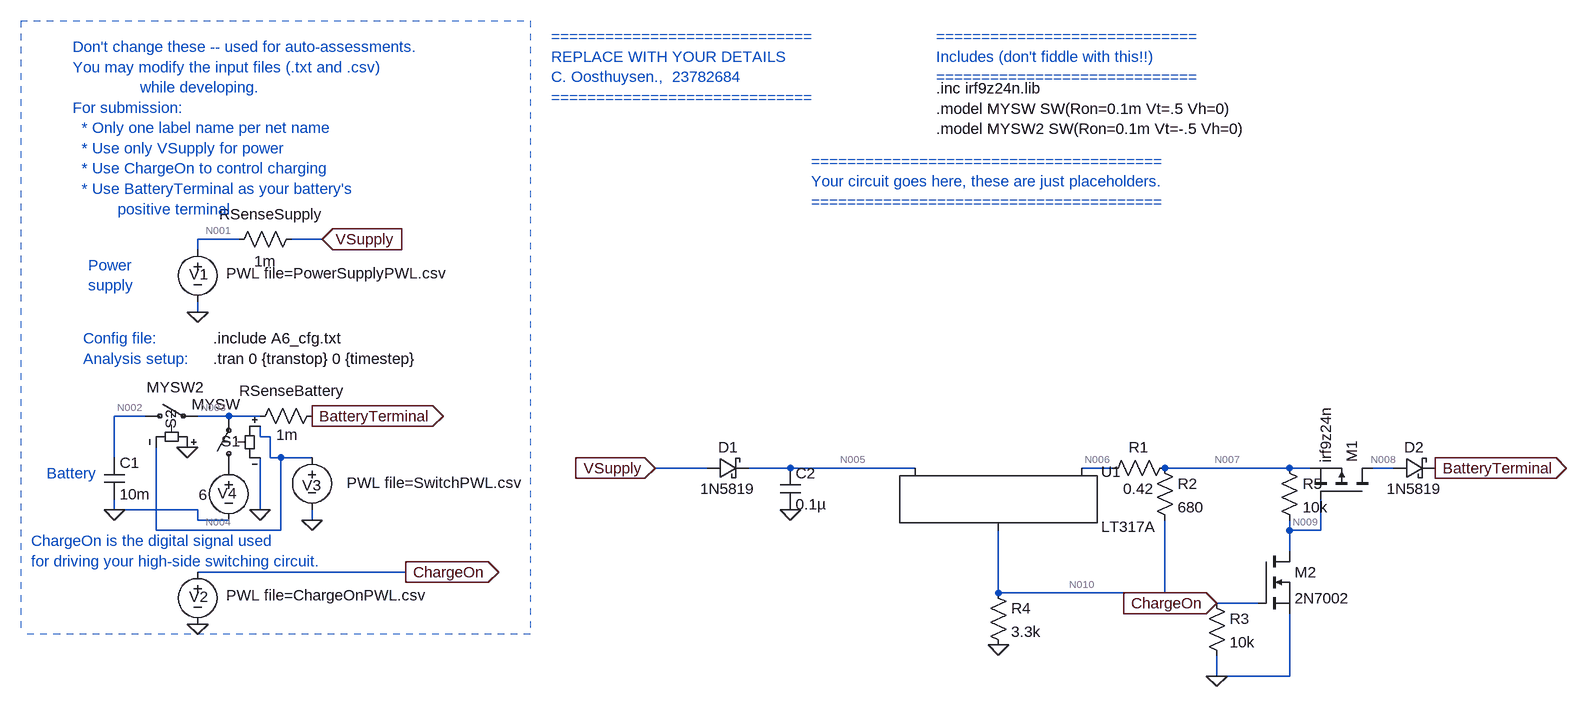
[diagram p0: schematic E344_23782684_A6b.asc]
E344_23782684_A6b.asc, the LTspice schematic file:
Version 4
SHEET 1 1824 680
WIRE -2032 -1088 -2096 -1088
WIRE -1904 -1088 -1952 -1088
WIRE -2096 -1072 -2096 -1088
WIRE -2096 -976 -2096 -992
WIRE -2176 -816 -2224 -816
WIRE -2048 -816 -2096 -816
WIRE -2000 -816 -2048 -816
WIRE -2000 -784 -2000 -800
WIRE -1984 -784 -2000 -784
WIRE -2224 -752 -2224 -816
WIRE -1984 -752 -1984 -784
WIRE -1968 -752 -1984 -752
WIRE -1920 -752 -1968 -752
WIRE -1312 -736 -1392 -736
WIRE -1184 -736 -1248 -736
WIRE -992 -736 -1184 -736
WIRE -688 -736 -736 -736
WIRE -416 -736 -608 -736
WIRE -384 -736 -416 -736
WIRE -256 -736 -288 -736
WIRE -2224 -672 -2224 -688
WIRE -2096 -672 -2224 -672
WIRE -2000 -672 -2000 -752
WIRE -2096 -656 -2096 -672
WIRE -2048 -656 -2096 -656
WIRE -1920 -656 -1920 -672
WIRE -2160 -640 -2160 -768
WIRE -1968 -640 -1968 -752
WIRE -1968 -640 -2160 -640
WIRE -416 -640 -416 -656
WIRE -368 -640 -368 -688
WIRE -368 -640 -416 -640
WIRE -416 -608 -416 -640
WIRE -1776 -576 -2096 -576
WIRE -864 -544 -864 -640
WIRE -608 -544 -608 -656
WIRE -608 -544 -864 -544
WIRE -464 -528 -528 -528
WIRE -528 -416 -528 -448
WIRE -416 -416 -416 -512
WIRE -416 -416 -528 -416
FLAG -2096 -976 0
FLAG -1904 -1088 VSupply
IOPIN -1904 -1088 In
FLAG -1920 -816 BatteryTerminal
IOPIN -1920 -816 Out
FLAG -1776 -576 ChargeOn
IOPIN -1776 -576 Out
FLAG -2096 -496 0
FLAG -1392 -736 VSupply
IOPIN -1392 -736 In
FLAG -192 -736 BatteryTerminal
IOPIN -192 -736 Out
FLAG -528 -528 ChargeOn
IOPIN -528 -528 In
FLAG -2000 -672 0
FLAG -1920 -656 0
FLAG -2112 -768 0
FLAG -2224 -672 0
FLAG -864 -464 0
FLAG -1184 -672 0
FLAG -528 -416 0
SYMBOL voltage -2096 -1088 R0
WINDOW 123 0 0 Left 0
WINDOW 39 0 0 Left 0
WINDOW 3 44 52 Left 2
WINDOW 0 -13 54 Left 2
SYMATTR Value PWL file=PowerSupplyPWL.csv
SYMATTR InstName V1
SYMBOL res -1904 -832 R90
WINDOW 0 -7 47 VBottom 2
WINDOW 3 29 54 VTop 2
SYMATTR InstName RSenseBattery
SYMATTR Value 1m
SYMBOL res -1936 -1104 R90
WINDOW 0 -7 47 VBottom 2
WINDOW 3 34 56 VTop 2
SYMATTR InstName RSenseSupply
SYMATTR Value 1m
SYMBOL cap -2240 -752 R0
SYMATTR InstName C1
SYMATTR Value 10m
SYMATTR SpiceLine2 IC=6
SYMBOL voltage -2096 -592 R0
WINDOW 123 0 0 Left 0
WINDOW 39 0 0 Left 0
WINDOW 3 44 52 Left 2
WINDOW 0 -13 54 Left 2
SYMATTR Value PWL file=ChargeOnPWL.csv
SYMATTR InstName V2
SYMBOL PowerProducts\\LT317A -864 -736 R0
SYMATTR InstName U1
SYMBOL pmos -288 -688 M270
SYMATTR InstName M1
SYMATTR Value irf9z24n
SYMATTR Prefix X
SYMATTR SpiceModel irf9z24n
SYMBOL nmos -464 -608 R0
SYMATTR InstName M2
SYMATTR Value 2N7002
SYMBOL schottky -1312 -720 R270
WINDOW 0 32 32 VTop 2
WINDOW 3 0 32 VBottom 2
SYMATTR InstName D1
SYMATTR Value 1N5819
SYMATTR Description Diode
SYMATTR Type diode
SYMBOL schottky -256 -720 R270
WINDOW 0 32 32 VTop 2
WINDOW 3 0 32 VBottom 2
SYMATTR InstName D2
SYMATTR Value 1N5819
SYMATTR Description Diode
SYMATTR Type diode
SYMBOL sw -2048 -720 R180
WINDOW 0 -18 57 Left 2
WINDOW 3 -17 114 Left 2
SYMATTR InstName S1
SYMATTR Value MYSW
SYMBOL voltage -1920 -768 R0
WINDOW 0 0 43 Top 2
WINDOW 3 188 70 Bottom 2
WINDOW 123 0 0 Left 0
WINDOW 39 0 0 Left 0
SYMATTR InstName V3
SYMATTR Value PWL file=SwitchPWL.csv
SYMBOL sw -2192 -816 R270
WINDOW 0 -20 55 Left 2
WINDOW 3 44 18 VRight 2
SYMATTR InstName S2
SYMATTR Value MYSW2
SYMBOL voltage -2048 -752 R0
WINDOW 0 -17 55 Left 2
WINDOW 3 -46 57 Left 2
WINDOW 123 0 0 Left 0
WINDOW 39 0 0 Left 0
SYMATTR InstName V4
SYMATTR Value 6
SYMBOL cap -1200 -736 R0
SYMATTR InstName C2
SYMATTR Value 0.1µ
SYMBOL res -592 -752 R90
WINDOW 0 0 56 VBottom 2
WINDOW 3 32 56 VTop 2
SYMATTR InstName R1
SYMATTR Value 0.42
SYMBOL res -624 -752 R0
SYMATTR InstName R2
SYMATTR Value 680
SYMBOL res -544 -544 R0
SYMATTR InstName R3
SYMATTR Value 10k
SYMBOL res -880 -560 R0
SYMATTR InstName R4
SYMATTR Value 3.3k
SYMBOL res -432 -752 R0
SYMATTR InstName R5
SYMATTR Value 10k
TEXT -2072 -904 Left 2 !.tran 0 {transtop} 0 {timestep}
TEXT -2072 -936 Left 2 !.include A6_cfg.txt
TEXT -2288 -1384 Left 2 ;Don't change these -- used for auto-assessments.\nYou may modify the input files (.txt and .csv) \n               while developing.\nFor submission: \n  * Only one label name per net name\n  * Use only VSupply for power\n  * Use ChargeOn to control charging\n  * Use BatteryTerminal as your battery's \n          positive terminal
TEXT -2272 -936 Left 2 ;Config file:
TEXT -2272 -904 Left 2 ;Analysis setup:
TEXT -2328 -728 Left 2 ;Battery
TEXT -2264 -1048 Left 2 ;Power\nsupply
TEXT -1552 -1400 Left 2 ;=============================\nREPLACE WITH YOUR DETAILS\nC. Oosthuysen.,  23782684\n=============================
TEXT -960 -1320 Left 2 !.inc irf9z24n.lib\n.model MYSW SW(Ron=0.1m Vt=.5 Vh=0)\n.model MYSW2 SW(Ron=0.1m Vt=-.5 Vh=0)
TEXT -2352 -624 Left 2 ;ChargeOn is the digital signal used \nfor driving your high-side switching circuit.
TEXT -960 -1400 Left 2 ;=============================\nIncludes (don't fiddle with this!!)\n=============================
TEXT -1152 -1208 Left 2 ;=======================================\nYour circuit goes here, these are just placeholders.\n=======================================
LINE Normal -1584 -1424 -1584 -480 2
LINE Normal -2368 -1424 -1584 -1424 2
LINE Normal -1584 -480 -2368 -480 2
LINE Normal -1584 -496 -1584 -496 2
LINE Normal -2368 -1424 -2368 -480 2

The netlist it stands for:
* E344_23782684_A6b.asc
V1 N001 0 PWL file=PowerSupplyPWL.csv
RSenseBattery BatteryTerminal N003 1m
RSenseSupply VSupply N001 1m
C1 N002 0 10m IC=6
V2 ChargeOn 0 PWL file=ChargeOnPWL.csv
XU1 N010 N006 N005 LT317A
XM1 N008 N009 N007 irf9z24n irf9z24n  ; pins D G S
M2 N009 ChargeOn 0 0 2N7002
D1 VSupply N005 1N5819
D2 N008 BatteryTerminal 1N5819
S1 P001 N003 N004 0 MYSW
V3 N004 0 PWL file=SwitchPWL.csv
S2 N002 N003 0 N004 MYSW2
V4 P001 0 6
C2 N005 0 0.1µ
R1 N007 N006 0.42
R2 N007 N010 680
R3 ChargeOn 0 10k
R4 N010 0 3.3k
R5 N007 N009 10k
.model D D
.lib standard.dio
.model NMOS NMOS
.model PMOS PMOS
.lib standard.mos
.tran 0 {transtop} 0 {timestep}
.include A6_cfg.txt
* Don't change these -- used for auto-assessments.
* You may modify the input files (.txt and .csv)
*                while developing.
* For submission:
*   * Only one label name per net name
*   * Use only VSupply for power
*   * Use ChargeOn to control charging
*   * Use BatteryTerminal as your battery's
*           positive terminal
* Config file:
* Analysis setup:
* Battery
* Power
* supply
* =============================
* REPLACE WITH YOUR DETAILS
* C. Oosthuysen.,  23782684
* =============================
.inc irf9z24n.lib
.model MYSW SW(Ron=0.1m Vt=.5 Vh=0)
.model MYSW2 SW(Ron=0.1m Vt=-.5 Vh=0)
* ChargeOn is the digital signal used
* for driving your high-side switching circuit.
* =============================
* Includes (don't fiddle with this!!)
* =============================
* =======================================
* Your circuit goes here, these are just placeholders.
* =======================================
.lib LTC.lib
.backanno
.end

* Results of the author's LTspice run, read from the files saved beside the schematic
* Operating Point, zero values left out:
*   V(n001) = 12 V
*   V(batteryterminal) = 6 V
*   V(n003) = 6 V
*   V(vsupply) = 12 V
*   V(n002) = 6 V
*   V(n005) = 11.85 V
*   V(n006) = 7.456 V
*   V(n010) = 6.208 V
*   V(n007) = 7.455 V
*   V(n008) = 6.001 V
*   V(n009) = 7.455 V
*   V(p001) = 6 V
*   V(n004) = 1 V
*   Id(M2) = 7.486 pA
*   Is(M2) = -7.486 pA
*   I(D2) = 661.1 nA
*   I(D1) = 1.882 mA
*   I(R5) = 16.4 pA
*   I(R4) = 1.881 mA
*   I(R2) = 1.834 mA
*   I(R1) = -1.834 mA
*   I(Rsensesupply) = -1.882 mA
*   I(Rsensebattery) = 661.1 nA
*   I(S1) = 661 nA
*   I(V4) = 661 nA
*   I(V1) = -1.882 mA
*   Ix(u1:1) = -47.54 µA
*   Ix(u1:2) = -1.834 mA
*   Ix(u1:3) = 1.882 mA
*   Ix(m1:1) = -661 nA
*   Ix(m1:2) = 1.454 pA
*   Ix(m1:3) = 661 nA
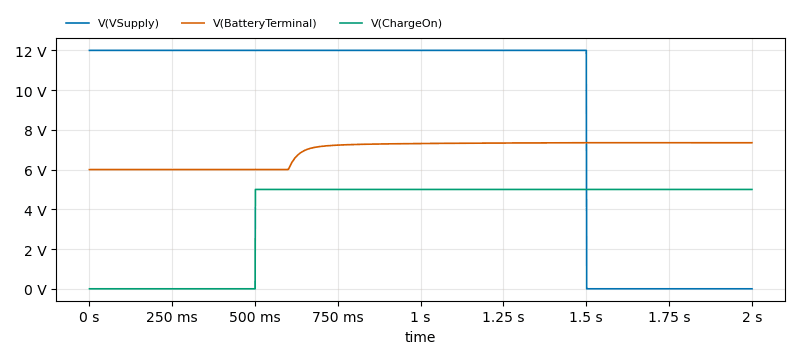
[diagram p1: Transient Analysis of E344_23782684_A6b.asc, plotted from the saved traces]
* Transient Analysis, 1 run:
*   V(VSupply): min 0 V, max 12 V, average 9.003 V, rms 10.39 V, last 0 V
*   V(BatteryTerminal): min 6 V, max 7.352 V, average 6.904 V, rms 6.931 V, last 7.35 V
*   V(ChargeOn): min 0 V, max 5 V, average 3.749 V, rms 4.329 V, last 5 V